# EAGLE design trrs-mitm (EAGLE 9.6.2)
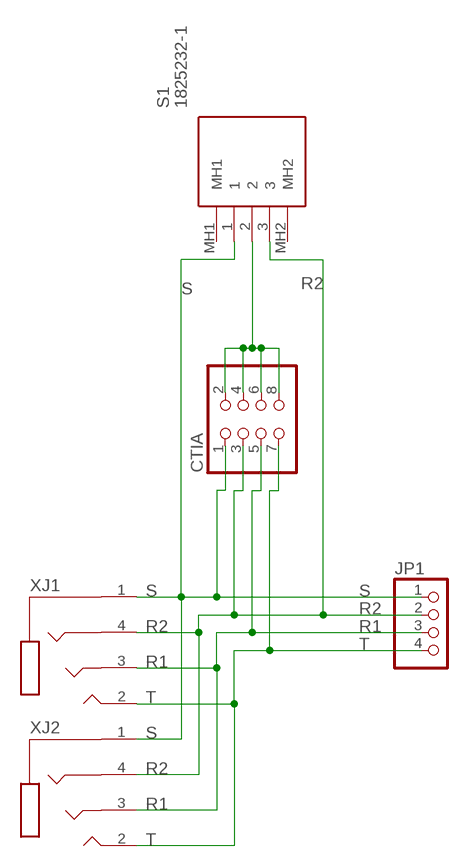
[diagram p0: schematic, sheet 1]

## Parts
CTIA  PINHD-2X4/90  [2X04/90]
JP1  PINHD-1X4  [1X04]
S1  1825232-1  [18252321]
XJ1  ASJ171B  [ASJ171B]
XJ2  ASJ171B  [ASJ171B]

## Nets
N$5: CTIA.2 CTIA.4 CTIA.6 CTIA.8 S1.2
R1: CTIA.5 JP1.3 XJ1.3 XJ2.3
R2: CTIA.3 JP1.2 S1.3 XJ1.4 XJ2.4
S: CTIA.1 JP1.1 S1.1 XJ1.1 XJ2.1
T: CTIA.7 JP1.4 XJ1.2 XJ2.2
Unconnected: S1.MH1 S1.MH2

## Library data of the parts
CTIA = pinhead:PINHD-2X4: PIN HEADER
JP1 = pinhead:PINHD-1X4: PIN HEADER
S1 = SamacSys_Parts:1825232-1: TE CONNECTIVITY - 1825232-1 - SLIDE SWITCH, SPDT, 0.2A, 30VDC, SOLDER Source: Datasheet <https://componentsearchengine.com/Datasheets/1/1825232-1.pdf>; DESCRIPTION: TE CONNECTIVITY - 1825232-1 - SLIDE SWITCH, SPDT, 0.2A, 30VDC, SOLDER; HEIGHT: 3.7mm; MANUFACTURER_NAME: TE Connectivity; MANUFACTURER_PART_NUMBER: 1825232-1; MOUSER_PART_NUMBER: 655-1825232-1; MOUSER_PRICE-STOCK: https://www.mouser.co.uk/ProductDetail/TE-Connectivity-PB/1825232-1?qs=kTKVN3NWb5FosGxaNC1%252BtA%3D%3D
XJ1 XJ2 = asj-171b-m-wp:ASJ171B: Adam Tech Interconnects ASJ-171B-M-WP Stereo Jack, 3.5mm, Water Resistant Size X

## Board
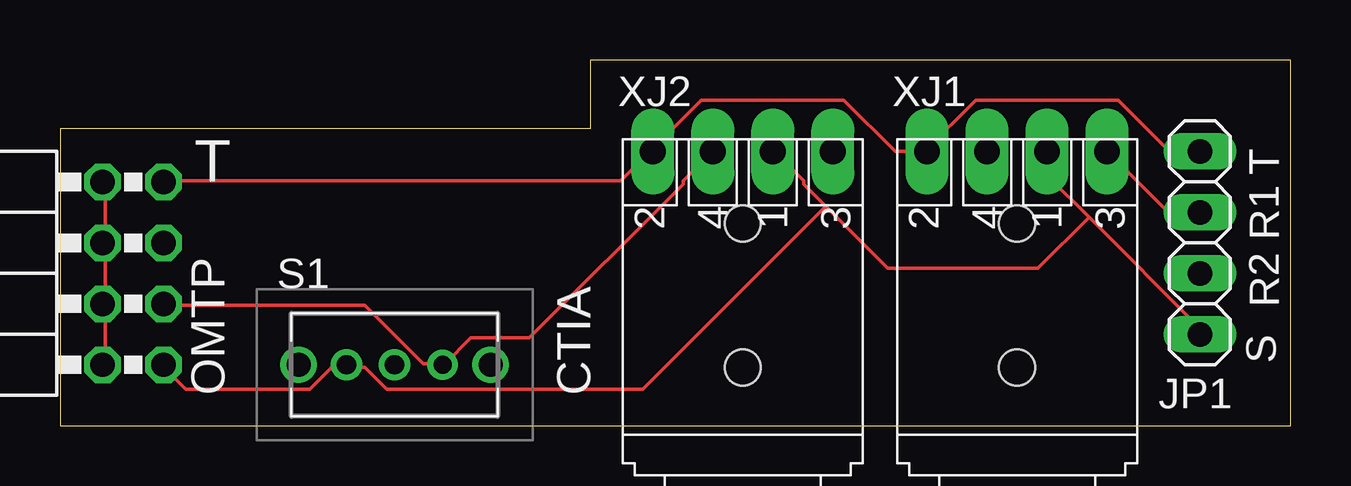
[diagram p1: board, top side]
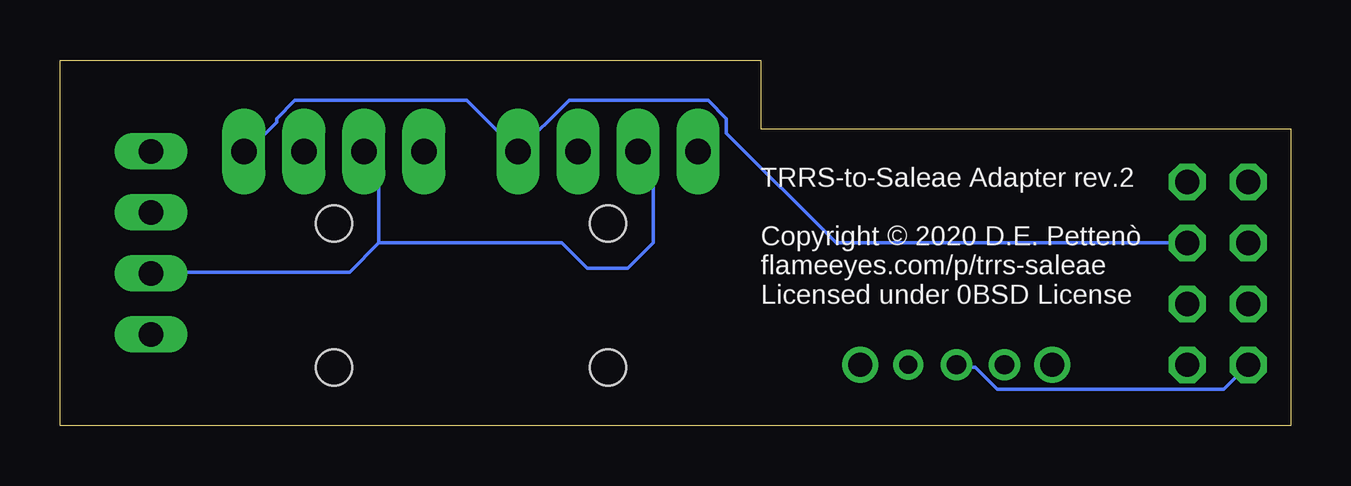
[diagram p2: board, bottom side, seen from below]

Size 51.29 x 15.24 mm. Coordinates in mm from the lower left corner, seen from the top.
Outline: 0,0 51.29,0 51.29,15.24 22.1,15.24 22.1,12.37 0,12.37 0,0
Copper layers (1*16): Top 0.035mm / dielectric 1.5mm / Bottom 0.035mm
Design rules "default": minimum track width 6mil, minimum drill 0.35mm, track to track 6mil, track to pad 6mil, pad to pad 6mil, via to via 6mil, smd to smd 6mil, copper to edge 40mil, drill to drill 6mil, minimum pad ring 10mil, minimum via ring 8mil, stop-mask expansion 4mil, vias tented up to drill 0mil, thermal gap 10mil

### Footprints (pad centres in the part's own frame; a part is rotated, then mirrored left to right if it is on the bottom)
2X04/90 = drill 1.016 octagon: 1 -3.81,-6.35; 2 -3.81,-3.81; 3 -1.27,-6.35; 4 -1.27,-3.81; 5 1.27,-6.35; 6 1.27,-3.81; 7 3.81,-6.35; 8 3.81,-3.81
1X04 = drill 1.016 long: 1 -3.81,0; 2 -1.27,0; 3 1.27,0; 4 3.81,0
18252321 = drill 0.8 pad 1.3: 1 0,0; 2 2,0 | drill 0.75 pad 1.2: 3 4,0 | drill 1 pad 1.5: MH1 -2,0; MH2 6,0
ASJ171B = drill 1.067 pad 1.8 long: 1 0,-1.25; 2 0,3.75; 3 0,-3.75; 4 0,1.25 | hole 1.5: -9,0; -3,0

### Placement (x,y rotation side)
CTIA  -2.03,6.35 90 top
JP1  47.5,7.62 90 top
S1  11.94,2.54 0 top
XJ1  39.88,11.43 90 top
XJ2  28.45,11.43 90 top

### Tracks (layer width: path | path; a pad name or v marks a point on that pad's centre or on a via)
N$5
  Top 0.152: 1.88,7.62 1.88,10.06 CTIA.8 | CTIA.2 1.88,2.59 1.88,5.03 CTIA.4 1.88,5.18 1.88,7.62 | 1.88,7.62 CTIA.6
  Bottom 0.152: CTIA.2 2.79,1.52 12.24,1.52 13.16,2.44 13.92,2.44 S1.2
R1
  Top 0.152: JP1.3 47.45,8.99 46.08,8.99 XJ1.3
  Bottom 0.152: CTIA.5 18.95,7.62 23.52,12.19 23.52,12.8 24.28,13.56 30.07,13.56 XJ2.3 | XJ2.3 34.34,13.56 41.5,13.56 42.27,12.8 42.27,12.65 43.48,11.43 XJ1.3 | XJ2.3
R2
  Top 0.152: CTIA.3 4.32,5.03 12.7,5.03 15.14,2.59 15.9,2.59 S1.3 16.05,2.59 17.12,3.66 19.56,3.66 25.96,10.06 25.96,10.21 27.18,11.43 XJ2.4
  Bottom 0.152: 38,7.62 39.22,6.4 47.45,6.4 JP1.2 | 38,7.62 38,10.82 38.61,11.43 XJ1.4 | 38,7.62 30.38,7.62 29.31,6.55 27.64,6.55 26.57,7.62 26.57,10.82 27.18,11.43 XJ2.4
S
  Top 0.152: 11.94,2.44 11.33,2.44 10.41,1.52 5.23,1.52 4.32,2.44 CTIA.1 | 42.88,8.69 41.2,10.36 41.2,11.43 XJ1.1 | 42.88,8.69 47.45,4.12 47.45,3.81 JP1.1 | 31.9,9.14 34.49,6.55 40.74,6.55 42.88,8.69 | 31.9,9.14 30.99,10.06 30.99,10.21 29.77,11.43 XJ2.1 | 11.94,2.44 12.7,2.44 13.61,1.52 24.28,1.52 31.9,9.14 | 11.94,2.44 S1.1
T
  Top 0.152: JP1.4 46.23,11.43 44.09,13.56 38.15,13.56 36.02,11.43 | 24.59,11.43 23.37,10.21 4.32,10.21 CTIA.7 | 36.02,11.43 34.8,11.43 32.66,13.56 26.72,13.56 24.59,11.43 | 36.02,11.43 XJ1.2 | 24.59,11.43 XJ2.2

### Text on the board
tPlace: T | T | R1 | R2 | S | OMTP | CTIA
bPlace: TRRS-to-Saleae Adapter rev.2 / / Copyright © 2020 D.E. Pettenò / flameeyes.com/p/trrs-saleae / Licensed under 0BSD License